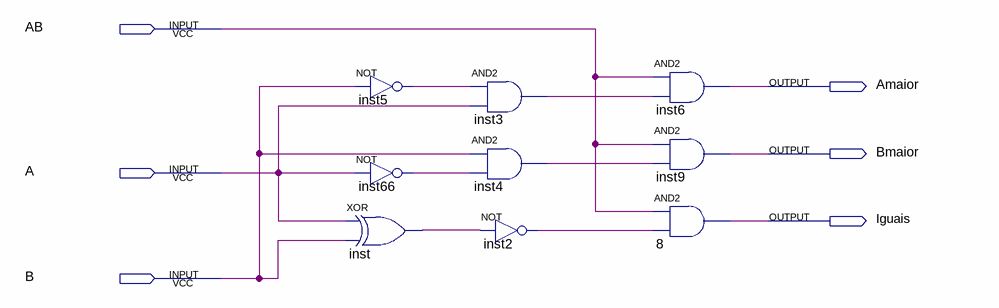
[diagram p0: schematic sheet]
// Quartus schematic comparador1bit.bdf as structural Verilog: 9 symbols, 6 pins
module comparador1bit (
  input  AB,
  input  A,
  input  B,
  output Amaior,
  output Bmaior,
  output Iguais
);

  wire inst2_out, inst3_out, inst4_out, inst5_out, inst66_out, inst_out;

  not inst5 (inst5_out, B);
  not inst66 (inst66_out, A);
  xor inst (inst_out, A, B);
  and inst3 (inst3_out, inst5_out, A);
  and inst4 (inst4_out, B, inst66_out);
  not inst2 (inst2_out, inst_out);
  and inst6 (Amaior, AB, inst3_out);
  and inst9 (Bmaior, AB, inst4_out);
  and u_8 (Iguais, AB, inst2_out);
endmodule
